# EAGLE design 5947BreakOut00 (EAGLE 5.10)
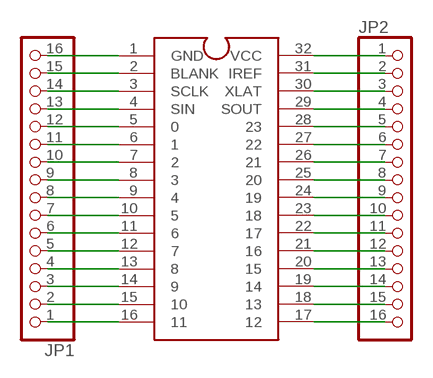
[diagram p0: schematic, sheet 1]

## Parts
JP1  PINHD-1X16  [1X16]
JP2  PINHD-1X16  [1X16]
U$1  TLC5947DAC  [DAP38]

## Nets
N$1: JP1.16 U$1.1(GND)
N$2: JP1.15 U$1.2(BLANK)
N$3: JP1.14 U$1.3(SCLK)
N$4: JP1.13 U$1.4(SIN)
N$5: JP1.12 U$1.5
N$6: JP1.11 U$1.6
N$7: JP1.10 U$1.7
N$8: JP1.9 U$1.8
N$9: JP1.8 U$1.9
N$10: JP1.7 U$1.10
N$11: JP1.6 U$1.11
N$12: JP1.5 U$1.12
N$13: JP1.4 U$1.13
N$14: JP1.3 U$1.14
N$15: JP1.2 U$1.15
N$16: JP1.1 U$1.16
N$17: JP2.1 U$1.32(VCC)
N$18: JP2.2 U$1.31(IREF)
N$19: JP2.3 U$1.30(XLAT)
N$20: JP2.4 U$1.29(SOUT)
N$21: JP2.5 U$1.28
N$22: JP2.6 U$1.27
N$23: JP2.7 U$1.26
N$24: JP2.8 U$1.25
N$25: JP2.9 U$1.24
N$26: JP2.10 U$1.23
N$27: JP2.11 U$1.22
N$28: JP2.12 U$1.21
N$29: JP2.13 U$1.20
N$30: JP2.14 U$1.19
N$31: JP2.15 U$1.18
N$32: JP2.16 U$1.17

## Library data of the parts
JP1 JP2 = pinhead:PINHD-1X16: PIN HEADER
U$1 = RazorConcepts:TLC5947DAC

## Board
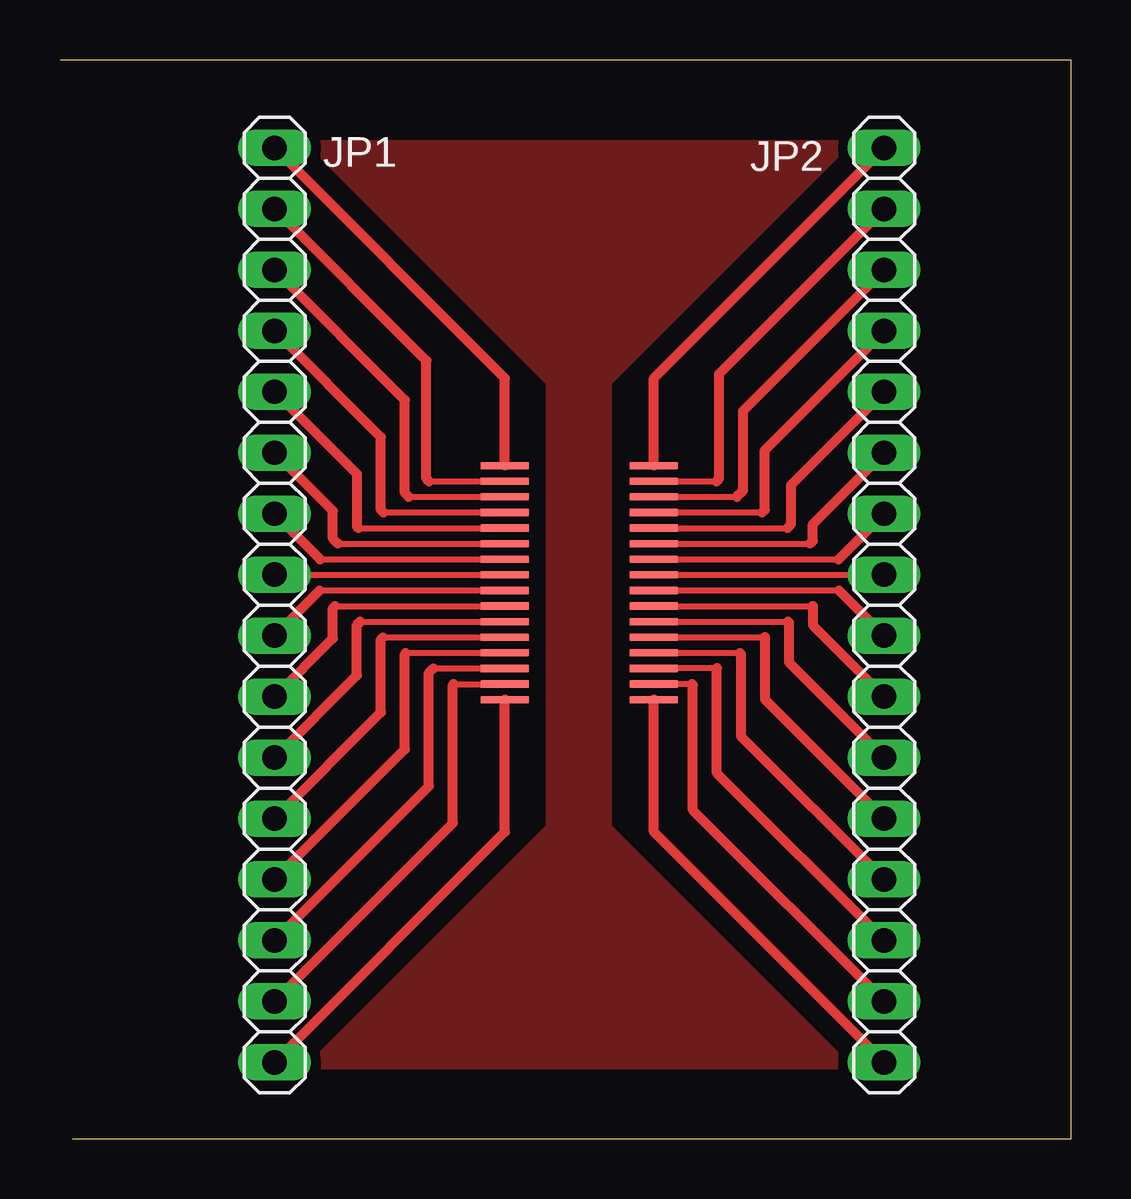
[diagram p1: board, top side]
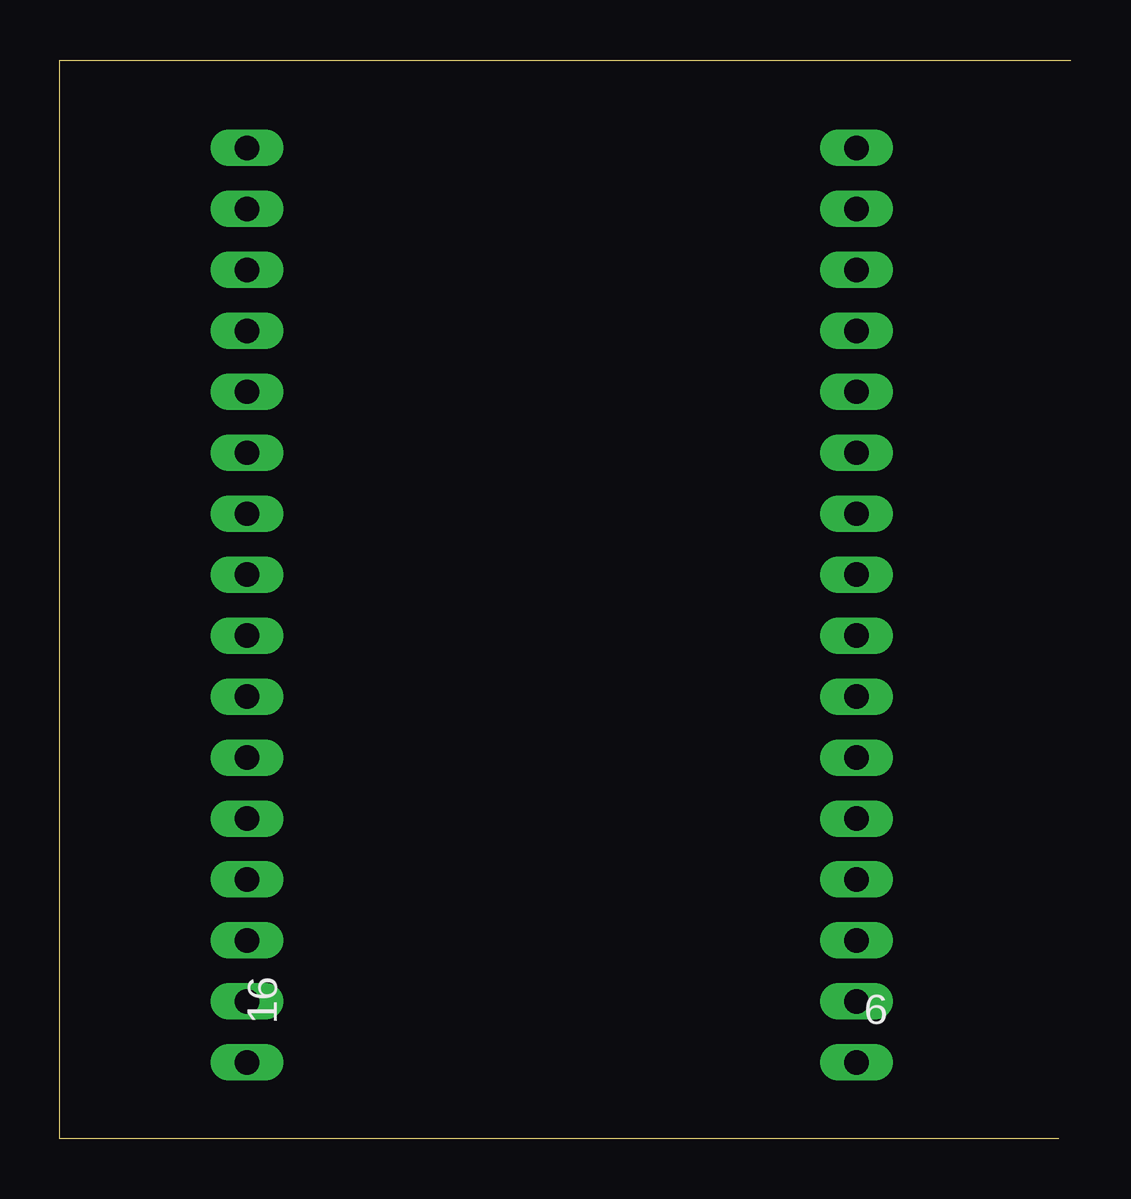
[diagram p2: board, bottom side, seen from below]

Size 42.12 x 44.94 mm. Coordinates in mm from the lower left corner, seen from the top.
Outline: 0.5,0 42.12,0 42.12,44.94 0,44.94
Copper layers (1*16): Top 0.035mm / dielectric 1.5mm / Bottom 0.035mm
Design rules "default": minimum track width 10mil, minimum drill 24mil, track to track 8mil, track to pad 8mil, pad to pad 8mil, via to via 8mil, smd to smd 8mil, copper to edge 40mil, drill to drill 8mil, minimum pad ring 10mil, minimum via ring 8mil, stop-mask expansion 4mil, vias tented up to drill 0mil, thermal gap 10mil

### Footprints (pad centres in the part's own frame; a part is rotated, then mirrored left to right if it is on the bottom)
1X16 = drill 1.016 long: 1 -19.05,0; 2 -16.51,0; 3 -13.97,0; 4 -11.43,0; 5 -8.89,0; 6 -6.35,0; 7 -3.81,0; 8 -1.27,0; 9 1.27,0; 10 3.81,0; 11 6.35,0; 12 8.89,0; 13 11.43,0; 14 13.97,0; 15 16.51,0; 16 19.05,0
DAP38 = smd 2 x 0.3: 1 -3.1,0.65; 2 -3.1,0; 3 -3.1,-0.65; 4 -3.1,-1.3; 5 -3.1,-1.95; 6 -3.1,-2.6; 7 -3.1,-3.25; 8 -3.1,-3.9; 9 -3.1,-4.55; 10 -3.1,-5.2; 11 -3.1,-5.85; 12 -3.1,-6.5; 13 -3.1,-7.15; 14 -3.1,-7.8; 15 -3.1,-8.45; 16 -3.1,-9.1; 17 3.1,-9.1; 18 3.1,-8.45; 19 3.1,-7.8; 20 3.1,-7.15; 21 3.1,-6.5; 22 3.1,-5.85; 23 3.1,-5.2; 24 3.1,-4.55; 25 3.1,-3.9; 26 3.1,-3.25; 27 3.1,-2.6; 28 3.1,-1.95; 29 3.1,-1.3; 30 3.1,-0.65; 31 3.1,0; 32 3.1,0.65

### Placement (x,y rotation side)
JP1  8.94,22.23 90 top
JP2  34.34,22.23 270 top
U$1  21.64,27.39 0 top

### Tracks (layer width: path | path; a pad name or v marks a point on that pad's centre or on a via)
GND
  pour Top (isolate 0.406): 10.36,41.5 32.86,41.5 22.86,31.5 22.86,13 32.86,3 10.36,3 20.36,13 20.36,31.5
N$1
  Top 0.406: U$1.1 18.54,31.68 JP1.16
N$2
  Top 0.254: 15.38,27.39 U$1.2
  Top 0.406: 15.38,27.39 15.26,27.5 15.26,32.41 JP1.15
N$3
  Top 0.254: 14.53,26.74 U$1.3
  Top 0.406: 14.53,26.74 14.36,26.9 14.36,30.77 JP1.14
N$4
  Top 0.254: 13.48,26.09 U$1.4
  Top 0.406: 13.48,26.09 13.36,26.2 13.36,29.23 JP1.13
N$5
  Top 0.254: 12.43,25.44 U$1.5
  Top 0.406: 12.43,25.44 12.36,25.5 12.36,27.69 JP1.12
N$6
  Top 0.254: 11.58,24.79 U$1.6
  Top 0.406: 11.58,24.79 11.36,25 11.36,26.15 JP1.11
N$7
  Top 0.254: 10.84,24.14 U$1.7
  Top 0.406: 10.84,24.14 JP1.10
N$8
  Top 0.254: 8.95,23.49 U$1.8
  Top 0.406: JP1.9 8.95,23.49
N$9
  Top 0.254: 10.82,22.84 U$1.9
  Top 0.406: JP1.8 10.82,22.84
N$10
  Top 0.254: 11.45,22.19 U$1.10
  Top 0.406: 11.45,22.19 11.36,22.1 11.36,20.84 JP1.7
N$11
  Top 0.254: 12.5,21.54 U$1.11
  Top 0.406: 12.5,21.54 12.36,21.4 12.36,19.3 JP1.6
N$12
  Top 0.254: 13.45,20.89 U$1.12
  Top 0.406: 13.45,20.89 13.36,20.8 13.36,17.76 JP1.5
N$13
  Top 0.254: 14.4,20.24 U$1.13
  Top 0.406: 14.4,20.24 14.36,20.2 14.36,16.22 JP1.4
N$14
  Top 0.254: 15.55,19.59 U$1.14
  Top 0.406: 15.55,19.59 15.36,19.4 15.36,14.68 JP1.3
N$15
  Top 0.254: 16.4,18.94 U$1.15
  Top 0.406: 16.4,18.94 16.36,18.9 16.36,13.14 JP1.2
N$16
  Top 0.406: U$1.16 18.54,12.78 JP1.1
N$17
  Top 0.406: U$1.32 24.74,31.68 JP2.1
N$18
  Top 0.254: U$1.31 27.35,27.39
  Top 0.406: 27.35,27.39 27.46,27.5 27.46,31.86 JP2.2
N$19
  Top 0.254: U$1.30 28.2,26.74
  Top 0.406: 28.2,26.74 28.46,27 28.46,30.32 JP2.3
N$20
  Top 0.254: U$1.29 29.25,26.09
  Top 0.406: 29.25,26.09 29.36,26.2 29.36,28.68 JP2.4
N$21
  Top 0.254: U$1.28 30.3,25.44
  Top 0.406: 30.3,25.44 30.46,25.6 30.46,27.24 JP2.5
N$22
  Top 0.254: U$1.27 31.25,24.79
  Top 0.406: 31.25,24.79 31.36,24.9 31.36,25.6 JP2.6
N$23
  Top 0.254: U$1.26 32.44,24.14
  Top 0.406: 32.44,24.14 JP2.7
N$24
  Top 0.254: U$1.25 34.33,23.49
  Top 0.406: 34.33,23.49 JP2.8
N$25
  Top 0.254: U$1.24 32.46,22.84
  Top 0.406: 32.46,22.84 JP2.9
N$26
  Top 0.254: U$1.23 31.35,22.19
  Top 0.406: 31.35,22.19 31.36,22.2 31.36,21.39 JP2.10
N$27
  Top 0.254: U$1.22 30.33,21.54
  Top 0.406: 30.33,21.54 30.36,21.5 30.36,19.85 JP2.11
N$28
  Top 0.254: U$1.21 29.35,20.89
  Top 0.406: 29.35,20.89 29.36,20.9 29.36,18.31 JP2.12
N$29
  Top 0.254: U$1.20 28.33,20.24
  Top 0.406: 28.33,20.24 28.36,20.2 28.36,16.77 JP2.13
N$30
  Top 0.254: 27.35,19.59 U$1.19
  Top 0.406: 27.35,19.59 27.36,19.6 27.36,15.23 JP2.14
N$31
  Top 0.254: 26.33,18.94 U$1.18
  Top 0.406: 26.33,18.94 26.36,18.9 26.36,13.69 JP2.15
N$32
  Top 0.406: U$1.17 24.74,12.78 JP2.16

### Text on the board
bPlace: 6 | 16
_tsilk: GND | VCC | BLANK | IREF | SCLK | XLAT | SIN | SOUT | 0 | 23 | 1 | 22 | 2 | 21 | 3 | 20 | 4 | 19 | 5 | 18 | 6 | 17 | 7 | 16 | 8 | 15 | 9 | 14 | 10 | 13 | 11 | diyelectronics.co.za | 12